# EAGLE design PCB-MicroTally (EAGLE 7.5.0)
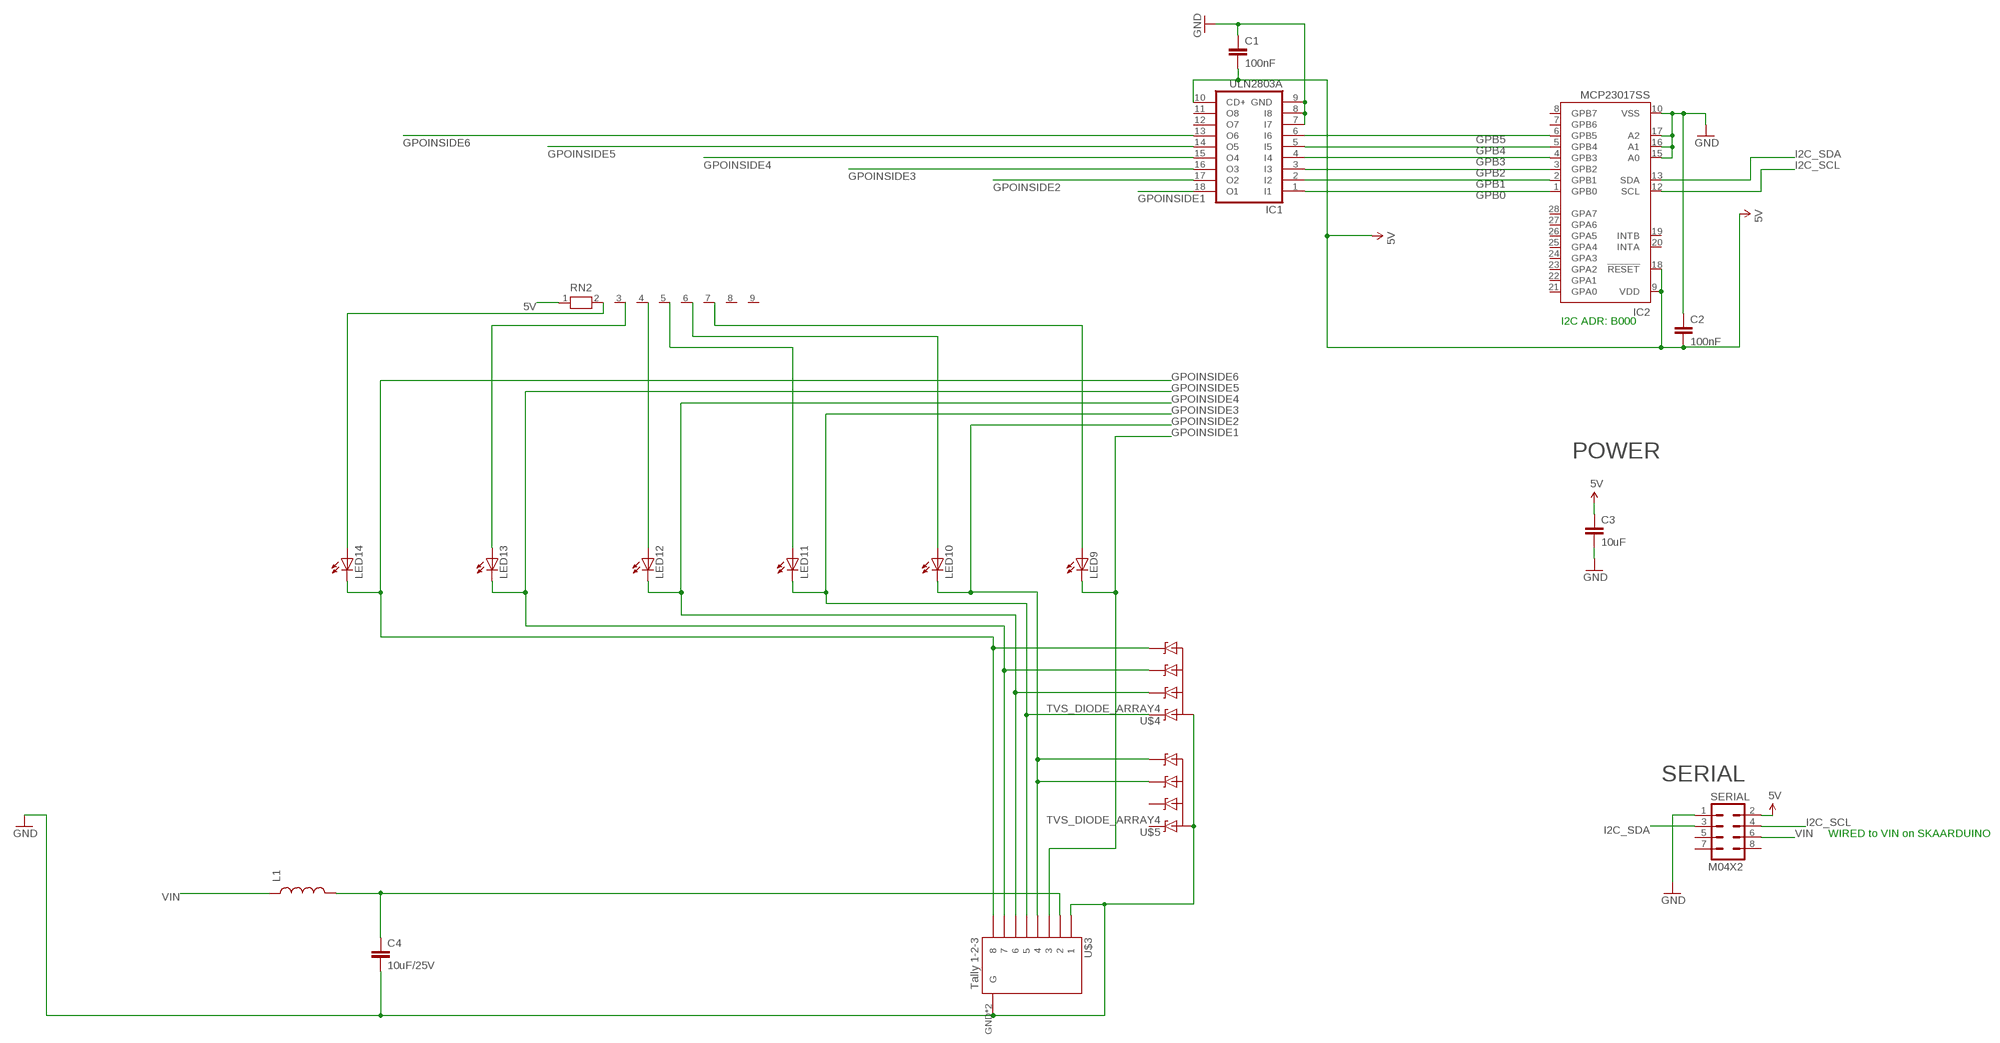
[diagram p0: schematic, sheet 1]

## Parts
C1  100nF  CAP0805  [0805]
C2  100nF  CAP0603-CAP  [0603-CAP]
C3  10uF  CAP0805  [0805]
C4  10uF/25V  CAP0805  [0805]
IC1  ULN2803A  ULN2803ASO18W  [SO18W]
IC2  MCP23017SS  [SSOP28]
L1  INDUCTOR0805  [0805]
LED9  LED3MM  [LED3MM]
LED10  LED3MM  [LED3MM]
LED11  LED3MM  [LED3MM]
LED12  LED3MM  [LED3MM]
LED13  LED3MM  [LED3MM]
LED14  LED3MM  [LED3MM]
RN2  RN08  [RN-9]
SERIAL  M04X2  [2X4]
U$3  Tally 1-2-3  RJ45-8_GNDUPRIGHT  [RJ45-8_GND_UPRIGHT]
U$4  TVS_DIODE_ARRAY4  [SOT23-6L]
U$5  TVS_DIODE_ARRAY4  [SOT23-6L]

## Nets
5V [Power]: C1.2 C2.2 C3.1 IC1.10(CD+) IC2.9(VDD) IC2.18(!RESET) RN2.1 SERIAL.2
GND [Power]: C1.1 C2.1 C3.2 C4.2 IC1.7(I7) IC1.8(I8) IC1.9(GND) IC2.10(VSS) IC2.15(A0) IC2.16(A1) IC2.17(A2) SERIAL.1 U$3.1 U$3.GND1(G) U$3.GND(G) U$4.2(GND) U$4.5(GND) U$5.2(GND) U$5.5(GND)
GPB0: IC1.1(I1) IC2.1(GPB0)
GPB1: IC1.2(I2) IC2.2(GPB1)
GPB2: IC1.3(I3) IC2.3(GPB2)
GPB3: IC1.4(I4) IC2.4(GPB3)
GPB4: IC1.5(I5) IC2.5(GPB4)
GPB5: IC1.6(I6) IC2.6(GPB5)
GPOINSIDE1: IC1.18(O1) LED9.K(C) U$3.3
GPOINSIDE2: IC1.17(O2) LED10.K(C) U$3.4 U$5.4(C) U$5.6(D)
GPOINSIDE3: IC1.16(O3) LED11.K(C) U$3.5 U$4.1(A)
GPOINSIDE4: IC1.15(O4) LED12.K(C) U$3.6 U$4.3(B)
GPOINSIDE5: IC1.14(O5) LED13.K(C) U$3.7 U$4.4(C)
GPOINSIDE6: IC1.13(O6) LED14.K(C) U$3.8 U$4.6(D)
I2C_SCL: IC2.12(SCL) SERIAL.4
I2C_SDA: IC2.13(SDA) SERIAL.3
N$2 [Power]: C4.1 L1.2 U$3.2
N$19: LED14.A RN2.2
N$20: LED13.A RN2.3
N$22: LED12.A RN2.4
N$23: LED11.A RN2.5
N$24: LED10.A RN2.6
N$26: LED9.A RN2.7
VIN: L1.1 SERIAL.6
Unconnected: IC1.11(O8) IC1.12(O7) IC2.7(GPB6) IC2.8(GPB7) IC2.19(INTB) IC2.20(INTA) IC2.21(GPA0) IC2.22(GPA1) IC2.23(GPA2) IC2.24(GPA3) IC2.25(GPA4) IC2.26(GPA5) IC2.27(GPA6) IC2.28(GPA7) RN2.8 RN2.9 SERIAL.5 SERIAL.7 SERIAL.8 U$5.1(A) U$5.3(B)

## Notes on the sheet
- I2C ADR: B000
- POWER
- SERIAL
- WIRED to VIN on SKAARDUINO

## Library data of the parts
C1-C4 = SparkFun:CAP: Capacitor Standard 0603 ceramic capacitor, and 0.1" leaded capacitor.
IC1 = uln-udn:ULN2803A: DRIVER ARRAY
IC2 = microchip:MCP23017: http://ww1.microchip.com/downloads/en/DeviceDoc/21952a.pdf Source: http://ww1.microchip.com/downloads/en/DeviceDoc/21952a.pdf; MF: MICROCHIP; MPN: MCP23017-E/SS; OC_FARNELL: 1467674; OC_NEWARK: 31K2960
L1 = SparkFun:INDUCTOR: Inductors Basic Inductor/Choke - 0603 and 1206. Footprints are not proven and vary greatly between part numbers.
LED9-LED14 = led:LED: LED OSRAM: - CHIPLED LG R971, LG N971, LY N971, LG Q971, LY Q971, LO R971, LY R971 LH N974, LH R974 LS Q976, LO Q976, LY Q976 LO Q996 - Hyper CHIPLED LW Q18S LB Q993, LB Q99A, LB R99A - SideLED LS A670, LO A670, LY A670, LG A670, LP A670 LB A673, LV A673, LT A673, LW A673 LH A674 LY A675 LS A676, LA A676, LO A676, LY A676, LW A676 LS A679, LY A679, LG A679 - Hyper Micro SIDELED® LS Y876, LA Y876, LO Y876, LY Y876 LT Y87S - SmartLED LW L88C, LW L88S LB L89C, LB L89S, LG L890 LS L89K, LO L89K, LY L89K LS L896, LA L896, LO L896, LY L896 - TOPLED LS T670, LO T670, LY T670, LG T670, LP T670 LSG T670, LSP T670, LSY T670, LOP T670, LYG T670 LG T671, LOG T671, LSG T671 LB T673, LV T673, LT T673, LW T673 LH T674 LS T676, LA T676, LO T676, LY T676, LB T676, LH T676, LSB T676, LW T676 LB T67C, LV T67C, LT T67C, LS T67K, LO T67K, LY T67K, LW E67C LS E67B, LA E67B, LO E67B, LY E67B, LB E67C, LV E67C, LT E67C LW T67C LS T679, LY T679, LG T679 LS T770, LO T770, LY T770, LG T770, LP T770 LB T773, LV T773, LT T773, LW T773 LH T774 LS E675, LA E675, LY E675, LS T675 LS T776, LA T776, LO T776, LY T776, LB T776 LHGB T686 LT T68C, LB T68C - Hyper Mini TOPLED® LB M676 - Mini TOPLED Santana® LG M470 LS M47K, LO M47K, LY M47K Source: http://www.osram.convergy.de LUXEON: - LUMILED® LXK2-PW12-R00, LXK2-PW12-S00, LXK2-PW14-U00, LXK2-PW14-V00 LXK2-PM12-R00, LXK2-PM12-S00, LXK2-PM14-U00 LXK2-PE12-Q00, LXK2-PE12-R00, LXK2-PE12-S00, LXK2-PE14-T00, LXK2-PE14-U00 LXK2-PB12-K00, LXK2-PB12-L00, LXK2-PB12-M00, LXK2-PB14-N00, LXK2-PB14-P00, LXK2-PB14-Q00 LXK2-PR12-L00, LXK2-PR12-M00, LXK2-PR14-Q00, LXK2-PR14-R00 LXK2-PD12-Q00, LXK2-PD12-R00, LXK2-PD12-S00 LXK2-PH12-R00, LXK2-PH12-S00 LXK2-PL12-P00, LXK2-PL12-Q00, LXK2-PL12-R00 Source: www.luxeon.com KINGBRIGHT: KA-3528ASYC Source: www.kingbright.com
RN2 = SKAARHOJ:RN08: RESISTOR NETWORK; OC_FARNELL: unknown; OC_NEWARK: unknown
SERIAL = SparkFun:M04X2
U$3 = SKAARHOJ:RJ45-8_GND
U$4 U$5 = SKAARHOJ:TVS_DIODE_ARRAY4

## Net classes
0 default: width 0.203 mm, drill 0.406 mm, clearance 0.203 mm
1 Power: width 0.305 mm, drill 0.406 mm, clearance 0.203 mm
2 RELAY LINES: width 0.203 mm, clearance 0.203 mm
3 INput lines: clearance 0.203 mm

## Board
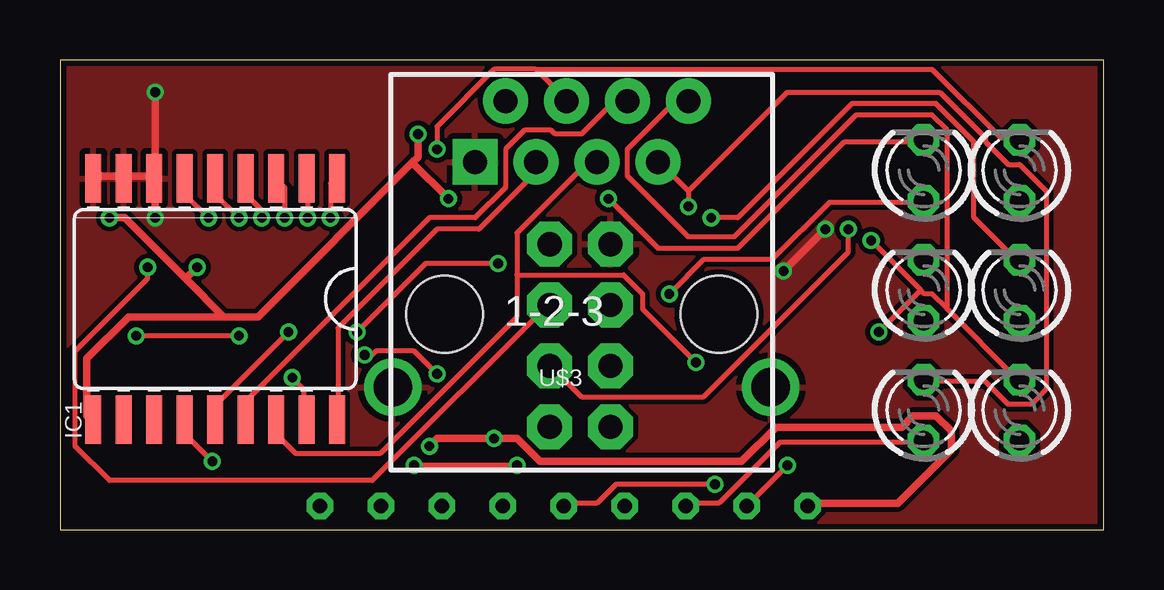
[diagram p1: board, top side]
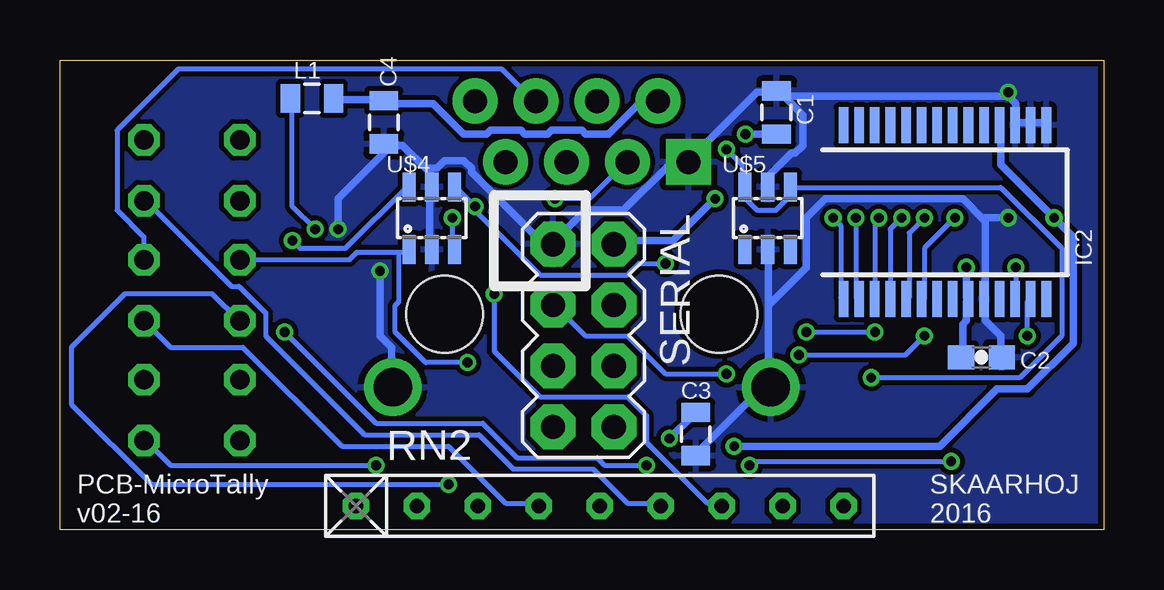
[diagram p2: board, bottom side, seen from below]

Size 43.5 x 19.6 mm. Coordinates in mm from the lower left corner, seen from the top.
Outline: 43.5,0 43.5,19.6 0,19.6 0,0 43.5,0
Copper layers (1*16): Top 0.035mm / dielectric 1.5mm / Bottom 0.035mm
Design rules "Fusion_eagle_rule_v1.1": minimum track width 6mil, minimum drill 12mil, track to track 6mil, track to pad 6mil, pad to pad 6mil, via to via 6mil, smd to smd 0mil, copper to edge 10mil, drill to drill 10mil, minimum pad ring 10mil, minimum via ring 6mil, stop-mask expansion 2mil, vias tented up to drill 100mil, thermal gap 10mil

### Footprints (pad centres in the part's own frame; a part is rotated, then mirrored left to right if it is on the bottom)
0805 = smd 0.8 x 1.2: 1 -0.9,0; 2 0.9,0
0603-CAP = smd 1.1 x 1: 1 -0.85,0; 2 0.85,0
SO18W = smd 0.66 x 2.032: 1 -5.08,-5.029; 2 -3.81,-5.029; 3 -2.54,-5.029; 4 -1.27,-5.029; 5 0,-5.029; 6 1.27,-5.029; 7 2.54,-5.029; 8 3.81,-5.029; 9 5.08,-5.029; 10 5.08,5.029; 11 3.81,5.029; 12 2.54,5.029; 13 1.27,5.029; 14 0,5.029; 15 -1.27,5.029; 16 -2.54,5.029; 17 -3.81,5.029; 18 -5.08,5.029
SSOP28 = smd 0.4 x 1.5: 1 -4.225,-3.625; 2 -3.575,-3.625; 3 -2.925,-3.625; 4 -2.275,-3.625; 5 -1.625,-3.625; 6 -0.975,-3.625; 7 -0.325,-3.625; 8 0.325,-3.625; 9 0.975,-3.625; 10 1.625,-3.625; 11 2.275,-3.625; 12 2.925,-3.625; 13 3.575,-3.625; 14 4.225,-3.625; 15 4.225,3.625; 16 3.575,3.625; 17 2.925,3.625; 18 2.275,3.625; 19 1.625,3.625; 20 0.975,3.625; 21 0.325,3.625; 22 -0.325,3.625; 23 -0.975,3.625; 24 -1.625,3.625; 25 -2.275,3.625; 26 -2.925,3.625; 27 -3.575,3.625; 28 -4.225,3.625
LED3MM = drill 0.813 octagon: A -1.27,0; K 1.27,0
RN-9 = drill 0.6 octagon: 1 -10.16,0; 2 -7.62,0; 3 -5.08,0; 4 -2.54,0; 5 0,0; 6 2.54,0; 7 5.08,0; 8 7.62,0; 9 10.16,0
2X4 = drill 1.016 pad 1.88 octagon: 1 -3.81,-1.27; 2 -3.81,1.27; 3 -1.27,-1.27; 4 -1.27,1.27; 5 1.27,-1.27; 6 1.27,1.27; 7 3.81,-1.27; 8 3.81,1.27
RJ45-8_GND_UPRIGHT = drill 1 pad 1.88 square: 1 -4.445,6.35 | drill 1 pad 1.88: 2 -3.175,8.89; 3 -1.905,6.35; 4 -0.635,8.89; 5 0.635,6.35; 6 1.905,8.89; 7 3.175,6.35; 8 4.445,8.89 | drill 1.6: GND -7.88,-3.05; GND1 7.88,-3.05 | hole 3.2: -5.715,0; 5.715,0
SOT23-6L = smd 0.55 x 1.2: 1 -0.95,-1.3; 2 0,-1.3; 3 0.95,-1.3; 4 0.95,1.3; 5 0,1.3; 6 -0.95,1.3

### Placement (x,y rotation side)
C1  13.63,17.41 270 bottom
C2  5.09,7.2 180 bottom
C3  17,4 270 bottom
C4  30,17 270 bottom
IC1  6.47,9.63 180 top
IC2  6.61,13.25 0 bottom
L1  33,18 0 bottom
LED9  36,15 90 top
LED10  40,15 90 top
LED11  36,10 90 top
LED12  40,10 90 top
LED13  36,5 90 top
LED14  40,5 90 top
RN2  21,1 0 bottom
SERIAL  21.68,8.11 270 bottom
U$3  21.75,9 0 top
U$4  28,13 0 bottom
U$5  14,13 0 bottom

### Tracks (layer width: path | path; a pad name or v marks a point on that pad's centre or on a via)
5V  (via drill 0.41)
  Top 0.305: RN2.1 31.27,1.11 34.92,1.11 37.15,3.33 37.15,4.13 36.51,4.76 35.56,4.76 35.08,4.29 29.84,4.29 28.42,2.86 20,2.86 19.05,3.81 v18.1,3.81 15.72,3.81 v15.4,3.49 | v14.92,16.51 14.92,15.56 14.68,15.32 | 14.68,15.32 8.26,8.89 6.83,8.89 | 6.83,8.89 2.86,8.89 1.11,7.14 1.11,4.76 1.27,4.6 IC1.10 | v2.06,13.02 2.7,13.02 5.24,10.48 | 6.83,8.89 5.24,10.48 | 5.24,10.48 v5.71,10.95 | 14.68,15.32 v16.19,13.81
  Bottom 0.305: v18.1,3.81 17.14,4.76 C3.1 | C2.2 5.87,7.3 5.87,8.57 5.71,8.73 5.71,9.53 IC2.9 5.71,9.68 v5.71,10.95 | v14.92,16.51 C1.2 | IC2.18 4.29,16.83 4.29,15.24 v2.06,13.02 1.27,12.22 1.27,7.78 3.17,5.87 4.45,5.87 6.83,3.49 v15.4,3.49 | v16.19,13.81 17.94,12.06 20.32,12.06 SERIAL.2
GND  (via drill 0.41)
  Top 0.305: IC1.9 1.43,14.76 2.54,14.76 IC1.8 2.7,14.76 3.81,14.76 IC1.7 | v3.97,13.02 3.97,14.61 IC1.7 | v31.91,12.54 v30.16,10.79 | v3.97,18.26 3.97,14.76 IC1.7
  Bottom 0.305: C2.1 4.29,7.3 4.29,8.1 4.92,8.73 4.92,9.53 IC2.10 4.92,9.68 4.92,12.86 5,12.94 | 13.97,6.19 13.97,6.03 U$3.GND 13.97,6.19 | 13.97,6.19 13.97,9.37 | 13.97,9.37 13.97,11.59 U$5.2 | 13.97,6.19 16.99,3.17 C3.2 | 5,12.94 5.87,13.81 11.59,13.81 12.38,13.02 12.38,10.95 13.97,9.37 | v3.97,13.02 4.92,13.02 5,12.94 | IC2.15 2.54,16.99 3.02,16.99 IC2.16 3.17,16.99 3.65,16.99 IC2.17 3.65,17.14 3.65,17.78 3.97,18.1 | U$5.5 13.97,14.45 13.97,14.76 13.02,15.72 12.86,15.72 12.54,16.03 12.54,17.3 13.49,18.26 C1.1 | 3.97,18.1 13.18,18.1 C1.1 | C1.1 13.65,18.26 14.45,18.26 17.3,15.4 U$3.1 17.46,15.24 18.1,15.24 20,13.34 21.59,13.34 22.86,12.06 SERIAL.1 23.02,12.06 23.5,12.06 26.35,14.92 26.35,15.08 26.67,15.4 27.46,15.4 27.78,15.08 28.1,15.08 28.18,15 | U$4.2 28.1,11.75 28.1,14.29 U$4.5 28.1,14.45 28.1,14.92 28.18,15 | 28.18,15 29.21,16.03 29.84,16.03 C4.2 29.84,15.88 31.91,13.81 v31.91,12.54 | v30.16,10.79 30.16,8.1 29.69,7.62 29.69,6.03 U$3.GND1 | 3.97,18.1 v3.97,18.26
  pour Bottom: 0,0 43.6,0 43.6,19.7 0,19.7
  pour Top: 0,0 43.6,0 43.6,19.7 0,19.7
GPB0  (via drill 0.41)
  Top 0.203: v11.27,13.02 11.27,14.45 11.43,14.61 IC1.1
  Bottom 0.203: v11.27,13.02 10.95,12.7 10.95,9.68 IC2.1
GPB1  (via drill 0.41)
  Top 0.203: v10.32,13.02 10.32,14.61 IC1.2
  Bottom 0.203: v10.32,13.02 10.32,9.68 IC2.2
GPB2  (via drill 0.41)
  Top 0.203: v9.37,13.02 9.37,14.29 9.05,14.61 IC1.3
  Bottom 0.203: v9.37,13.02 9.53,12.86 9.53,9.68 IC2.3
GPB3  (via drill 0.41)
  Top 0.203: v8.41,13.02 8.41,13.34 7.78,13.97 7.78,14.61 IC1.4
  Bottom 0.203: v8.41,13.02 8.89,12.54 8.89,9.68 IC2.4
GPB4  (via drill 0.41)
  Top 0.203: v7.46,13.02 6.51,13.97 6.51,14.61 IC1.5
  Bottom 0.203: v7.46,13.02 8.1,12.38 8.1,9.68 IC2.5
GPB5  (via drill 0.41)
  Top 0.203: v6.19,13.02 5.24,13.97 5.24,14.61 IC1.6
  Bottom 0.203: v6.19,13.02 7.46,11.75 7.46,9.68 IC2.6
GPOINSIDE1  (via drill 0.41)
  Top 0.203: IC1.18 11.59,4.6 11.59,8.41 15.72,12.54 17.46,12.54 19.84,14.92 19.84,15.24 U$3.3 | v22.86,13.81 24.92,11.75 28.26,11.75 32.7,16.19 35.88,16.19 LED9.K
  Bottom 0.203: v22.86,13.81 21.43,13.81 20,15.24 U$3.3
GPOINSIDE2  (via drill 0.41)
  Top 0.203: v15.72,15.88 15.72,16.83 18.1,19.21 19.84,19.21 | 19.84,19.21 21.11,17.94 U$3.4 | v9.68,6.35 10.16,5.87 10.16,4.6 IC1.17 | 19.84,19.21 36.35,19.21 39.21,16.35 39.85,16.35 LED10.K
  Bottom 0.203: v15.72,15.88 15.08,15.24 15.08,14.45 U$5.6 14.92,14.29 14.92,13.81 14.45,13.34 13.65,13.34 13.18,13.81 13.18,14.29 U$5.4 13.02,14.29 4.29,14.29 1.75,11.75 1.75,8.1 3.49,6.35 v9.68,6.35
GPOINSIDE3  (via drill 0.41)
  Top 0.203: 19.05,10.64 19.05,12.38 21.91,15.24 22.38,15.24 U$3.5 | 19.05,10.64 19.05,8.89 13.34,3.17 9.84,3.17 9.05,3.97 9.05,4.45 IC1.16 | v26.51,6.99 24.29,9.21 24.29,9.84 23.5,10.64 19.05,10.64
  Bottom 0.203: 29.37,11.59 31.11,11.59 31.43,11.27 35.88,11.27 LED11.K | 29.37,11.59 29.05,11.59 U$4.1 | 29.37,11.59 29.37,9.53 29.53,9.37 29.53,8.26 28.26,6.99 v26.51,6.99
GPOINSIDE4  (via drill 0.41)
  Top 0.203: v27.15,13.02 28.26,13.02 33.02,17.78 36.51,17.78 38.1,16.19 38.1,13.02 39.85,11.27 LED12.K | IC1.15 7.78,4.6 7.78,5.4 15.4,13.02 17.3,13.02 18.57,14.29 18.57,15.88 19.37,16.67 20.48,16.67 20.64,16.51 21.75,16.51 23.02,17.78 23.65,17.78 U$3.6
  Bottom 0.203: v27.15,13.02 27.15,11.75 U$4.3 | LED12.K 40.01,12.22 41.12,13.34 41.12,16.67 38.58,19.21 25.08,19.21 23.81,17.94 U$3.6
GPOINSIDE5  (via drill 0.41)
  Top 0.203: 26.19,14.13 v26.19,13.49 | 26.19,14.13 25.08,15.24 U$3.7 | v9.53,8.26 6.51,5.24 6.51,4.6 IC1.14 | v12.38,8.26 15.24,11.11 v18.26,11.11 | 26.19,14.13 30.32,18.26 36.67,18.26 38.58,16.35 38.58,16.19 39.53,15.24 40.01,15.24 41.12,14.13 41.12,5.87 40.48,5.24 39.53,5.24 38.58,6.19 36.04,6.19 LED13.K
  Bottom 0.203: v26.19,13.49 26.99,14.29 U$4.4 27.15,14.29 23.5,10.64 19.84,10.64 19.37,11.11 v18.26,11.11 | v12.38,8.26 v9.53,8.26
GPOINSIDE6  (via drill 0.41)
  Top 0.203: 35.88,10 36.04,9.84 36.35,9.84 36.99,9.21 | 35.88,10 v33.81,12.06 | 36.99,9.21 39.85,6.35 LED14.K | v6.35,2.86 5.24,3.97 5.24,4.45 IC1.13 | v19.05,2.7 v14.76,2.7 | 35.88,10 v34.13,8.26 | 36.99,9.21 36.99,16.67 36.35,17.3 33.18,17.3 28.1,12.22 26.19,12.22 23.65,14.76 23.65,15.88 25.56,17.78 26.19,17.78 U$3.8
  Bottom 0.203: v33.81,12.06 33.5,11.75 31.59,11.75 29.05,14.29 U$4.6 | v6.35,2.86 14.61,2.86 v14.76,2.7 | v19.05,2.7 20.8,2.7 21.11,3.02 24.45,3.02 25.88,4.45 30.32,4.45 v34.13,8.26
I2C_SCL  (via drill 0.41)
  Top 0.203: v3.65,10.95 3.65,10.48 0.64,7.46 0.64,3.49 2.06,2.06 13.02,2.06 20.32,9.37 SERIAL.4
  Bottom 0.203: v3.65,10.95 3.65,9.68 IC2.12
I2C_SDA  (via drill 0.41)
  Top 0.203: v7.46,8.1 v3.17,8.1 | v12.7,7.3 13.02,7.3 13.18,7.46 14.76,7.46 v15.72,6.51
  Bottom 0.203: v3.17,8.1 3.17,9.53 IC2.13 | v7.46,8.1 8.26,7.3 v12.7,7.3 | v15.72,6.51 18.26,6.51 19.84,8.1 21.59,8.1 22.86,9.37 SERIAL.3
N$2
  Bottom 0.305: L1.2 32.07,17.94 30,17.94 C4.1 29.84,17.78 27.94,17.78 26.67,16.51 25.72,16.51 25.56,16.67 24.29,16.67 24.13,16.51 23.18,16.51 23.02,16.67 21.75,16.67 21.59,16.51 20.64,16.51 19.37,17.78 18.73,17.78 U$3.2
N$19  (via drill 0.41)
  Top 0.203: v30.32,2.7 28.73,1.11 RN2.2
  Bottom 0.203: v30.32,2.7 38.89,2.7 39.85,3.65 LED14.A
N$20
  Top 0.203: RN2.3 26.19,1.11 27.46,1.11 30,3.65 35.88,3.65 LED13.A
N$22
  Bottom 0.203: RN2.4 23.65,1.11 24.92,1.11 27.3,3.49 31.75,3.49 35.88,7.62 38.89,7.62 39.85,8.57 LED12.A
N$23  (via drill 0.41)
  Top 0.203: v27.3,1.91 23.18,1.91 22.38,1.11 21.11,1.11 RN2.5
  Bottom 0.203: v27.3,1.91 39.69,1.91 43.02,5.24 43.02,7.62 40.8,9.84 37.15,9.84 36.04,8.73 LED11.A
N$24
  Bottom 0.203: RN2.6 18.57,1.11 19.84,1.11 21.27,2.54 24.61,2.54 26.04,3.97 30.8,3.97 34.92,8.1 34.92,9.05 36.04,10.16 36.35,10.16 39.85,13.65 LED10.A
N$26  (via drill 0.41)
  Top 0.203: v25.4,9.84 26.83,11.27 29.69,11.27 32.07,13.65 35.88,13.65 LED9.A
  Bottom 0.203: v25.4,9.84 25.4,7.46 23.5,5.56 19.84,5.56 19.05,4.76 19.05,3.65 16.51,1.11 16.03,1.11 RN2.7
VIN  (via drill 0.41)
  Top 0.203: v32.86,12.54 32.86,11.59 26.83,5.56 21.75,5.56 20.48,6.83 SERIAL.6
  Bottom 0.203: v32.86,12.54 33.81,13.49 33.81,17.94 L1.1

### Text on the board
_tsilk: 1-2-3
_bsilk: SKAARHOJ / 2016 | PCB-MicroTally / v02-16